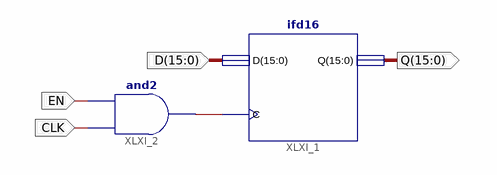
[diagram p0: schematic sheet 1]
// Xilinx ISE schematic ffd16_w_en.sch (artix7) as structural Verilog: 2 symbols, 4 ports
module ffd16_w_en (
  input  [15:0] D,
  input  EN,
  input  CLK,
  output [15:0] Q
);

  wire XLXN_1;

  ifd16 XLXI_1 (.C(XLXN_1), .D(D), .Q(Q));
  and XLXI_2 (XLXN_1, CLK, EN);
endmodule
